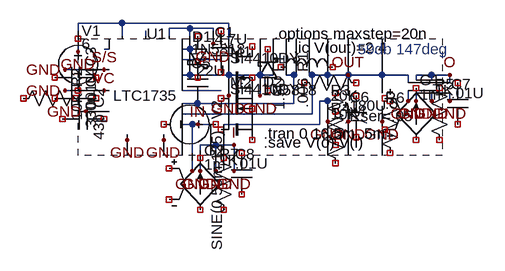
[diagram p0: schematic 125.asc]
125.asc, the LTspice schematic file:
Version 3
SHEET 1 1176 688
WIRE 288 372 288 364
WIRE 344 372 344 364
WIRE 260 232 252 232
WIRE 200 296 192 296
WIRE 596 344 596 336
WIRE 680 344 680 320
WIRE 628 344 628 320
WIRE 212 236 212 224
WIRE 444 304 444 300
WIRE 236 328 224 328
WIRE 252 264 240 264
WIRE 260 264 252 264
WIRE 572 332 372 332
WIRE 572 272 572 332
WIRE 568 272 572 272
WIRE 596 272 572 272
WIRE 596 288 596 272
WIRE 628 272 596 272
WIRE 628 304 628 272
WIRE 680 300 680 272
WIRE 444 228 444 192
WIRE 212 192 280 192
WIRE 212 204 212 192
WIRE 252 296 240 296
WIRE 260 296 252 296
WIRE 420 200 384 200
WIRE 260 328 252 328
WIRE 544 316 372 316
WIRE 544 272 544 316
WIRE 532 272 544 272
WIRE 548 272 544 272
WIRE 584 348 436 348
WIRE 584 312 584 348
WIRE 596 312 584 312
WIRE 596 316 596 312
WIRE 596 308 596 312
WIRE 444 276 444 272
WIRE 444 252 444 272
WIRE 432 296 372 296
WIRE 432 248 372 248
WIRE 420 200 420 204
WIRE 420 220 420 224
WIRE 492 272 492 280
WIRE 492 296 492 304
WIRE 280 212 280 192
WIRE 372 272 384 272
WIRE 512 272 492 272
WIRE 492 272 444 272
WIRE 372 232 384 232
WIRE 384 232 384 252
WIRE 384 268 384 272
WIRE 384 272 444 272
WIRE 352 212 352 200
WIRE 352 200 384 200
WIRE 384 200 384 212
WIRE 384 228 384 232
WIRE 316 212 316 204
WIRE 224 264 192 264
WIRE 224 296 220 296
WIRE 280 192 444 192
WIRE 416 348 396 348
WIRE 396 348 388 348
WIRE 628 272 680 272
WIRE 680 272 720 272
WIRE 720 272 720 284
WIRE 720 296 720 312
WIRE 732 312 732 300
WIRE 732 280 732 272
WIRE 732 272 756 272
WIRE 756 272 756 280
WIRE 756 300 756 312
WIRE 756 272 784 272
WIRE 784 272 784 284
WIRE 784 300 784 312
WIRE 388 348 388 392
WIRE 388 404 388 420
WIRE 400 420 400 408
WIRE 400 388 400 380
WIRE 400 380 424 380
WIRE 424 380 424 388
WIRE 424 408 424 420
WIRE 424 380 452 380
WIRE 452 380 452 392
WIRE 452 408 452 420
WIRE 388 348 372 348
FLAG 288 372 GND
FLAG 344 372 GND
FLAG 192 296 GND
FLAG 192 264 GND
FLAG 596 344 GND
FLAG 680 344 GND
FLAG 628 344 GND
FLAG 212 236 GND
FLAG 444 304 GND
FLAG 224 328 GND
FLAG 252 264 S/S
FLAG 628 272 OUT
FLAG 252 296 VC
FLAG 420 224 GND
FLAG 492 304 GND
FLAG 396 348 IN
FLAG 756 312 GND
FLAG 732 312 GND
FLAG 720 312 GND
FLAG 784 312 GND
FLAG 424 420 GND
FLAG 400 420 GND
FLAG 388 420 GND
FLAG 452 420 GND
FLAG 452 380 I
FLAG 784 272 O
SYMBOL RES 224 292 R90
WINDOW 0 0 14 Right 0
WINDOW 3 8 14 Left 0
SYMATTR InstName R2
SYMATTR Value 10K
SYMBOL res 592 284 R0
WINDOW 0 9 11 Left 0
WINDOW 3 9 20 Left 0
SYMATTR InstName R3
SYMATTR Value 20K
SYMBOL res 592 312 R0
WINDOW 0 9 11 Left 0
WINDOW 3 9 20 Left 0
SYMATTR InstName R4
SYMATTR Value 10K
SYMBOL res 544 268 M90
WINDOW 0 0 14 Right 0
WINDOW 3 8 14 Left 0
SYMATTR InstName R1
SYMATTR Value .006
SYMBOL cap 240 292 R90
WINDOW 0 0 8 Right 0
WINDOW 3 8 8 Left 0
SYMATTR InstName C4
SYMATTR Value 330p
SYMBOL cap 252 324 R90
WINDOW 0 0 8 Right 0
WINDOW 3 8 8 Left 0
SYMATTR InstName C2
SYMATTR Value 43p
SYMBOL cap 240 260 R90
WINDOW 0 0 8 Right 0
WINDOW 3 8 8 Left 0
SYMATTR InstName C3
SYMATTR Value .001U
SYMBOL polcap 624 304 R0
WINDOW 0 6 2 Left 0
WINDOW 3 6 15 Left 0
WINDOW 39 6 31 Left 0
WINDOW 123 6 23 Left 0
SYMATTR InstName C6
SYMATTR Value 180U
SYMATTR Value2 x4
SYMATTR SpiceLine Rser=.05
SYMBOL VOLTAGE 212 200 R0
WINDOW 0 6 4 Left 0
WINDOW 3 6 24 Left 0
SYMATTR InstName V1
SYMATTR Value 6
SYMBOL ind 508 276 R270
WINDOW 0 8 14 Left 0
WINDOW 3 1 14 Right 0
SYMATTR InstName L1
SYMATTR Value 1.5U
SYMBOL NMOS 432 228 R0
WINDOW 0 14 8 Left 0
WINDOW 3 14 18 Left 0
SYMATTR InstName M1
SYMATTR Value Si4410DY
SYMBOL nmos 432 276 R0
WINDOW 0 14 8 Left 0
WINDOW 3 14 18 Left 0
SYMATTR InstName M2
SYMATTR Value Si4410DY
SYMBOL cap 416 204 R0
WINDOW 0 6 2 Left 0
WINDOW 3 6 13 Left 0
SYMATTR InstName C1
SYMATTR Value 4.7U
SYMBOL cap 380 252 R0
WINDOW 0 6 2 Left 0
WINDOW 3 8 13 Left 0
SYMATTR InstName C5
SYMATTR Value .22U
SYMBOL schottky 380 212 R0
WINDOW 0 8 1 Left 0
WINDOW 3 7 20 Left 0
SYMATTR InstName D1
SYMATTR Value 1N5818
SYMBOL schottky 488 296 M180
WINDOW 0 9 14 Left 0
WINDOW 3 9 1 Left 0
SYMATTR InstName D2
SYMATTR Value 1N5818
SYMBOL POWERPRODUCTS\LTC1735 316 280 R0
WINDOW 0 2 -72 Left 0
WINDOW 3 0 24 Center 0
SYMATTR InstName U1
SYMATTR Value LTC1735
SYMBOL res 676 296 R0
WINDOW 0 9 11 Left 0
WINDOW 3 9 20 Left 0
SYMATTR InstName R6
SYMATTR Value .5
SYMBOL voltage 440 348 R90
WINDOW 0 -7 14 Right 0
WINDOW 3 8 14 Left 0
WINDOW 39 24 14 Left 0
WINDOW 123 40 14 Left 0
SYMATTR InstName V2
SYMATTR Value SINE(0 50m 125)
SYMBOL g 732 276 R0
WINDOW 0 6 4 Left 0
WINDOW 3 6 26 Left 0
SYMATTR InstName G1
SYMATTR Value 1m
SYMBOL res 752 276 R0
WINDOW 0 9 10 Left 0
WINDOW 3 9 19 Left 0
SYMATTR InstName R5
SYMATTR Value 1K
SYMBOL cap 780 284 R0
WINDOW 0 6 2 Left 0
WINDOW 3 6 16 Left 0
SYMATTR InstName C7
SYMATTR Value .01U
SYMBOL g 400 384 R0
WINDOW 0 6 4 Left 0
WINDOW 3 6 26 Left 0
SYMATTR InstName G2
SYMATTR Value 1m
SYMBOL res 420 384 R0
WINDOW 0 9 10 Left 0
WINDOW 3 9 19 Left 0
SYMATTR InstName R7
SYMATTR Value 1K
SYMBOL cap 448 392 R0
WINDOW 0 6 2 Left 0
WINDOW 3 6 16 Left 0
SYMATTR InstName C8
SYMATTR Value .01U
TEXT 498 362 Left 0 !.tran 0 16.5m .5m
text 544 230 Left 0 !.ic V(out)=2.4
text 514 208 Left 0 !.options maxstep=20n
text 642 232 Left 0 ;59db 147deg
text 498 376 Left 0 !.save V(o) V(i)

The netlist it stands for:
* 125.asc
R2 NC_01 NC_02 10K
R3 NC_03 NC_04 20K
R4 NC_05 NC_06 10K
R1 NC_07 NC_08 .006
C4 NC_09 NC_10 330p
C2 NC_11 NC_12 43p
C3 NC_13 NC_14 .001U
C6 NC_15 NC_16 180U x4 Rser=.05
V1 NC_17 NC_18 6
L1 NC_19 NC_20 1.5U
* M1: Si4410DY (symbol NMOS not certain, pin order unknown); nets seen at it: 
* M2: Si4410DY (symbol nmos not certain, pin order unknown); nets seen at it: 
C1 NC_27 NC_28 4.7U
C5 NC_29 N005 .22U
D1 NC_30 NC_31 1N5818
D2 NC_32 NC_33 1N5818
* U1: LTC1735 (symbol POWERPRODUCTS\LTC1735 not available, pin order unknown); nets seen at it: GND, I, IN, N001, N002, N003, N004, N005, N006, N007, N008, N009, N010, N011, N012, O, OUT, S/S, VC
R6 NC_34 NC_35 .5
V2 NC_36 NC_37 SINE(0 50m 125)
G1 NC_38 NC_39 NC_40 NC_41 1m
R5 NC_42 NC_43 1K
C7 NC_44 NC_45 .01U
G2 NC_46 NC_47 NC_48 NC_49 1m
R7 NC_50 NC_51 1K
C8 NC_52 NC_53 .01U
.model D D
.lib standard.dio
.tran 0 16.5m .5m
.ic V(out)=2.4
.options maxstep=20n
* 59db 147deg
.save V(o) V(i)
.backanno
.end